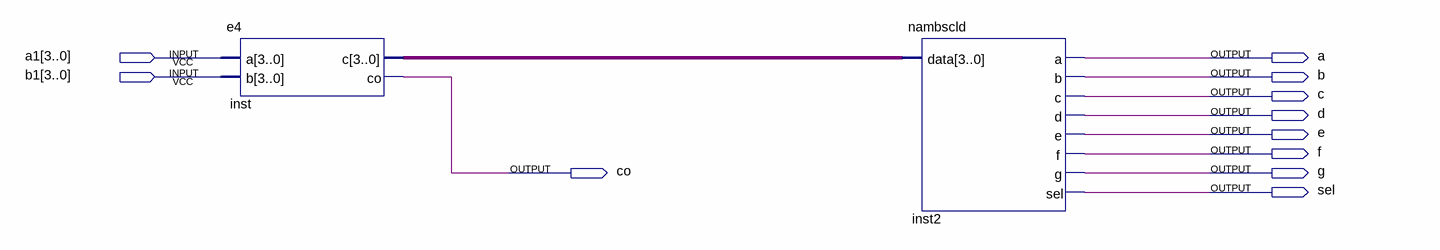
[diagram p0: schematic sheet]
// Quartus schematic Block1.bdf as structural Verilog: 2 symbols, 11 pins
module Block1 (
  input  [3:0] a1,
  input  [3:0] b1,
  output a,
  output b,
  output c,
  output d,
  output e,
  output f,
  output co,
  output g,
  output sel
);

  wire [3:0] inst_c;

  e4 inst (.a(a1), .b(b1), .c(inst_c), .co(co));
  nambscld inst2 (.data(inst_c), .a(a), .b(b), .c(c), .d(d), .e(e), .f(f), .g(g), .sel(sel));
endmodule
